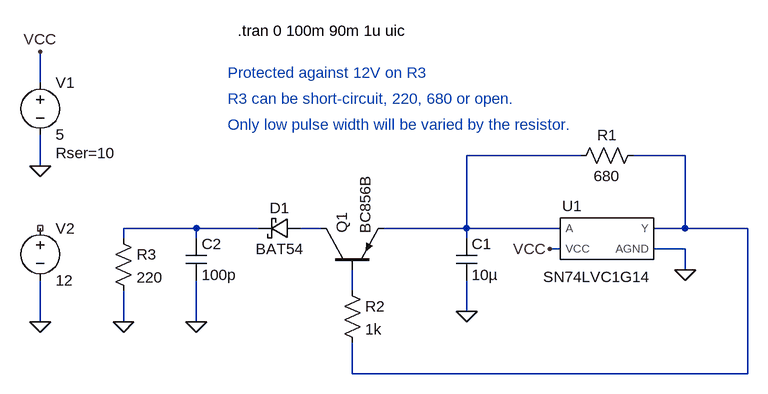
[diagram p0: schematic Inverted_schmittrigger.asc]
Inverted_schmittrigger.asc, the LTspice schematic file:
Version 4
SHEET 1 1236 680
WIRE 144 -80 144 -128
WIRE 976 32 800 32
WIRE 1136 32 1056 32
WIRE 144 48 144 0
WIRE 384 144 272 144
WIRE 480 144 384 144
WIRE 576 144 544 144
WIRE 800 144 800 32
WIRE 800 144 672 144
WIRE 944 144 800 144
WIRE 1136 144 1136 32
WIRE 1136 144 1088 144
WIRE 1232 144 1136 144
WIRE 272 160 272 144
WIRE 384 160 384 144
WIRE 800 160 800 144
WIRE 944 176 928 176
WIRE 1136 176 1088 176
WIRE 1136 208 1136 176
WIRE 624 240 624 208
WIRE 800 272 800 224
WIRE 144 288 144 224
WIRE 272 288 272 240
WIRE 384 288 384 224
WIRE 624 368 624 320
WIRE 1232 368 1232 144
WIRE 1232 368 624 368
FLAG 144 48 0
FLAG 144 -128 VCC
FLAG 928 176 VCC
FLAG 800 272 0
FLAG 1136 208 0
FLAG 272 288 0
FLAG 144 288 0
FLAG 384 288 0
SYMBOL voltage 144 -96 R0
WINDOW 123 0 0 Left 0
WINDOW 39 24 124 Left 2
SYMATTR SpiceLine Rser=10
SYMATTR InstName V1
SYMATTR Value 5
SYMBOL res 1072 16 R90
WINDOW 0 0 56 VBottom 2
WINDOW 3 32 56 VTop 2
SYMATTR InstName R1
SYMATTR Value 680
SYMBOL cap 784 160 R0
SYMATTR InstName C1
SYMATTR Value 10µ
SYMBOL AutoGenerated\\SN74LVC1G14 992 160 R0
WINDOW 0 -30 -35 Bottom 2
SYMATTR InstName U1
SYMBOL pnp 576 208 R270
SYMATTR InstName Q1
SYMATTR Value BC856B
SYMBOL res 608 224 R0
SYMATTR InstName R2
SYMATTR Value 1k
SYMBOL res 256 144 R0
SYMATTR InstName R3
SYMATTR Value 220
SYMBOL voltage 144 128 R0
SYMATTR InstName V2
SYMATTR Value 12
SYMBOL schottky 544 128 R90
WINDOW 0 0 32 VBottom 2
WINDOW 3 32 32 VTop 2
SYMATTR InstName D1
SYMATTR Value BAT54
SYMATTR Description Diode
SYMATTR Type diode
SYMBOL cap 368 160 R0
SYMATTR InstName C2
SYMATTR Value 100p
TEXT 448 -160 Left 2 !.tran 0 100m 90m 1u uic
TEXT 432 -96 Left 2 ;Protected against 12V on R3
TEXT 432 -56 Left 2 ;R3 can be short-circuit, 220, 680 or open.
TEXT 432 -16 Left 2 ;Only low pulse width will be varied by the resistor.

The netlist it stands for:
* Inverted_schmittrigger.asc
V1 VCC 0 5 Rser=10
R1 N002 N001 680
C1 N001 0 10µ
XU1 N002 N001 VCC 0 SN74LVC1G14  ; pins Y A VCC AGND
Q1 N004 N005 N001 0 BC856B
R2 N005 N002 1k
R3 N003 0 220
V2 NC_01 0 12
D1 N004 N003 BAT54
C2 N003 0 100p
.model D D
.lib standard.dio
.model NPN NPN
.model PNP PNP
.lib standard.bjt
.tran 0 100m 90m 1u uic
* Protected against 12V on R3
* R3 can be short-circuit, 220, 680 or open.
* Only low pulse width will be varied by the resistor.
.lib SN74LVC1G14.cir
.backanno
.end